# Altium project Placa E3.PrjPcb
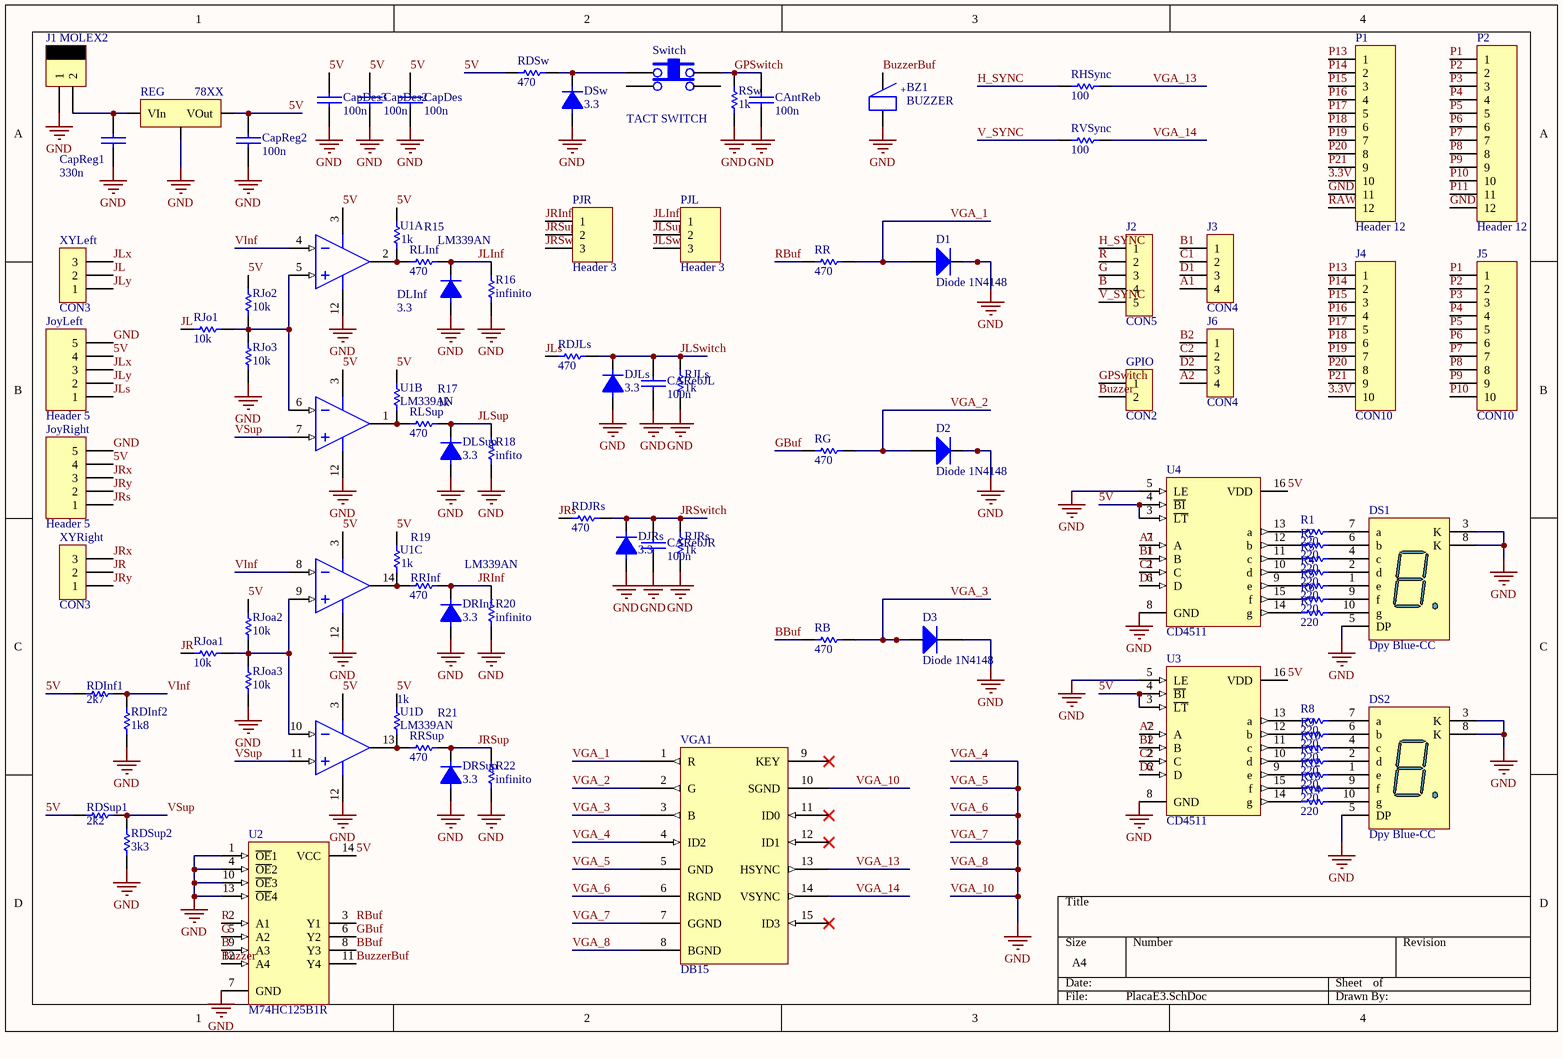
[diagram p0: PlacaE3.SchDoc]
1 sheet, 90 parts. Net scope: global (net labels, ports and power ports of the same name join across sheets).
Board file: PlacaE3.PcbDoc

## Sheet PlacaE3.SchDoc
size A4

### Parts
BZ1  BUZZER  [BUZZER 12MM]
CAntReb  100n  [CAP200]
CapDes  100n  [CAP200]
CapDes2  100n  [CAP200]
CapDes3  100n  [CAP200]
CapReg1  330n  [CAP200]
CapReg2  100n  [CAP200]
CARebJL  100n  [CAP200]
CARebJR  100n  [CAP200]
D1  Diode 1N4148  [DO-35]
D2  Diode 1N4148  [DO-35]
D3  Diode 1N4148  [DO-35]
DJLs  3.3  [DO41]
DJRs  3.3  [DO41]
DLInf  3.3  [DO41]
DLSup  3.3  [DO41]
DRInf  3.3  [DO41]
DRSup  3.3  [DO41]
DS1  Dpy Blue-CC  [H]
DS2  Dpy Blue-CC  [H]
DSw  3.3  [DO41]
GPIO  CON2  [SIP2]
J1  MOLEX2  [MOLEX2]
J2  CON5  [SIP5]
J3  CON4  [SIP4]
J4  CON10  [SIP10]
J5  CON10  [SIP10]
J6  CON4  [SIP4]
JoyLeft  Header 5  [HDR1X5]
JoyRight  Header 5  [HDR1X5]
P1  Header 12  [HDR1X12]
P2  Header 12  [HDR1X12]
PJL  Header 3  [HDR1X3]
PJR  Header 3  [HDR1X3]
R1  220  [0805]
R2  220  [0805]
R3  220  [0805]
R4  220  [0805]
R5  220  [0805]
R6  220  [0805]
R7  220  [0805]
R8  220  [0805]
R9  220  [0805]
R10  220  [0805]
R11  220  [0805]
R12  220  [0805]
R13  220  [0805]
R14  220  [0805]
R15  1k  [0805]
R16  infinito  [0805]
R17  1k  [0805]
R18  infito  [0805]
R19  1k  [0805]
R20  infinito  [0805]
R21  1k  [0805]
R22  infinito  [0805]
RB  470  [RES400]
RDInf1  2k7  [RES400]
RDInf2  1k8  [RES400]
RDJLs  470  [RES400]
RDJRs  470  [RES400]
RDSup1  2k2  [RES400]
RDSup2  3k3  [RES400]
RDSw  470  [RES400]
REG  78XX  [TO-220 V]
RG  470  [RES400]
RHSync  100  [RES400]
RJLs  1k  [RES400]
RJo1  10k  [0805]
RJo2  10k  [0805]
RJo3  10k  [0805]
RJoa1  10k  [0805]
RJoa2  10k  [0805]
RJoa3  10k  [0805]
RJRs  1k  [RES400]
RLInf  470  [RES400]
RLSup  470  [RES400]
RR  470  [RES400]
RRInf  470  [RES400]
RRSup  470  [RES400]
RSw  1k  [RES400]
RVSync  100  [RES400]
Switch  TACT SWITCH  [TACTSWITCH]
U1  LM339AN  [DIP14]  (parts A,B,C,D of 4)
U2  M74HC125B1R  [DIP14]
U3  CD4511  [DIP16]
U4  CD4511  [DIP16]
VGA1  DB15  [DB15_DSUB]
XYLeft  CON3  [SIP3]
XYRight  CON3  [SIP3]

### Nets
GND: BZ1.2 CAntReb.2 CapDes.2 CapDes2.2 CapDes3.2 CapReg1.2 CapReg2.2 CARebJL.2 CARebJR.2 D1.2(K) D2.2(K) D3.2(K) DJLs.1 DJRs.1 DLInf.1 DLSup.1 DRInf.1 DRSup.1 DS1.3(K) DS1.5(DP) DS1.8(K) DS2.3(K) DS2.5(DP) DS2.8(K) DSw.1 J1.1 JoyLeft.5 JoyRight.5 P1.11 P2.12 R16.1 R18.1 R20.1 R22.1 RDInf2.1 RDSup2.1 REG.2(GND) RJLs.1 RJo3.1 RJoa3.1 RJRs.1 RSw.1 U1.12(V-) U2.1(~{OE}1) U2.4(~{OE}2) U2.7(GND) U2.10(~{OE}3) U2.13(~{OE}4) U3.5(LE) U3.8(GND) U4.5(LE) U4.8(GND) VGA1.4(ID2) VGA1.5(GND) VGA1.6(RGND) VGA1.7(GGND) VGA1.8(BGND) VGA1.10(SGND)  [also labelled VGA_10, VGA_4, VGA_5, VGA_6, VGA_7, VGA_8]
3.3V: J4.10 P1.10
5V: CapDes.1 CapDes2.1 CapDes3.1 CapReg2.1 JoyLeft.4 JoyRight.4 R15.2 R17.2 R19.2 R21.2 RDInf1.1 RDSup1.1 RDSw.1 REG.3(VOut) RJo2.2 RJoa2.2 U1.3(V+) U2.14(VCC) U3.3(~{LT}) U3.4(~{BI}) U3.16(VDD) U4.3(~{LT}) U4.4(~{BI}) U4.16(VDD)
A1: J3.4 U4.7(A)
A2: J6.4 U3.7(A)
B: J2.4 U2.9(A3)
B1: J3.1 U4.1(B)
B2: J6.1 U3.1(B)
BBuf: RB.1 U2.8(Y3)
Buzzer: GPIO.2 U2.12(A4)
BuzzerBuf: BZ1.1 U2.11(Y4)
C1: J3.2 U4.2(C)
C2: J6.2 U3.2(C)
D1: J3.3 U4.6(D)
D2: J6.3 U3.6(D)
G: J2.3 U2.5(A2)
GBuf: RG.1 U2.6(Y2)
GPSwitch: CAntReb.1 GPIO.1 RSw.2 Switch.3
H_SYNC: J2.1 RHSync.1
JL: RJo1.1 XYLeft.2
JLInf: DLInf.2 PJL.1 R16.2 RLInf.2
JLs: JoyLeft.1 RDJLs.1
JLSup: DLSup.2 PJL.2 R18.2 RLSup.2
JLSwitch: CARebJL.1 DJLs.2 PJL.3 RDJLs.2 RJLs.2
JLx: JoyLeft.3 XYLeft.3
JLy: JoyLeft.2 XYLeft.1
JR: RJoa1.1 XYRight.2
JRInf: DRInf.2 PJR.1 R20.2 RRInf.2
JRs: JoyRight.1 RDJRs.1
JRSup: DRSup.2 PJR.2 R22.2 RRSup.2
JRSwitch: CARebJR.1 DJRs.2 PJR.3 RDJRs.2 RJRs.2
JRx: JoyRight.3 XYRight.3
JRy: JoyRight.2 XYRight.1
P1: J5.1 P2.1
P2: J5.2 P2.2
P3: J5.3 P2.3
P4: J5.4 P2.4
P5: J5.5 P2.5
P6: J5.6 P2.6
P7: J5.7 P2.7
P8: J5.8 P2.8
P9: J5.9 P2.9
P10: J5.10 P2.10
P11: P2.11
P13: J4.1 P1.1
P14: J4.2 P1.2
P15: J4.3 P1.3
P16: J4.4 P1.4
P17: J4.5 P1.5
P18: J4.6 P1.6
P19: J4.7 P1.7
P20: J4.8 P1.8
P21: J4.9 P1.9
R: J2.2 U2.2(A1)
RAW: P1.12
RBuf: RR.1 U2.3(Y1)
V_SYNC: J2.5 RVSync.1
VGA_1: D1.1(A) RR.2 VGA1.1(R)
VGA_2: D2.1(A) RG.2 VGA1.2(G)
VGA_3: D3.1(A) RB.2 VGA1.3(B)
VGA_13: RHSync.2 VGA1.13(HSYNC)
VGA_14: RVSync.2 VGA1.14(VSYNC)
VInf: RDInf1.2 RDInf2.2 U1.4(IN-) U1.8(IN-)
VSup: RDSup1.2 RDSup2.2 U1.7(IN+) U1.11(IN+)
NetCapReg1_1: CapReg1.1 J1.2 REG.1(VIn)
NetDS1_1: DS1.1(e) R5.2
NetDS1_2: DS1.2(d) R4.2
NetDS1_4: DS1.4(c) R3.2
NetDS1_6: DS1.6(b) R2.2
NetDS1_7: DS1.7(a) R1.2
NetDS1_9: DS1.9(f) R6.2
NetDS1_10: DS1.10(g) R7.2
NetDS2_1: DS2.1(e) R12.2
NetDS2_2: DS2.2(d) R11.2
NetDS2_4: DS2.4(c) R10.2
NetDS2_6: DS2.6(b) R9.2
NetDS2_7: DS2.7(a) R8.2
NetDS2_9: DS2.9(f) R13.2
NetDS2_10: DS2.10(g) R14.2
NetDSw_2: DSw.2 RDSw.2 Switch.1
NetR1_1: R1.1 U4.13(a)
NetR2_1: R2.1 U4.12(b)
NetR3_1: R3.1 U4.11(c)
NetR4_1: R4.1 U4.10(d)
NetR5_1: R5.1 U4.9(e)
NetR6_1: R6.1 U4.15(f)
NetR7_1: R7.1 U4.14(g)
NetR8_1: R8.1 U3.13(a)
NetR9_1: R9.1 U3.12(b)
NetR10_1: R10.1 U3.11(c)
NetR11_1: R11.1 U3.10(d)
NetR12_1: R12.1 U3.9(e)
NetR13_1: R13.1 U3.15(f)
NetR14_1: R14.1 U3.14(g)
NetR15_1: R15.1 RLInf.1 U1.2(OUT)
NetR17_1: R17.1 RLSup.1 U1.1(OUT)
NetR19_1: R19.1 RRInf.1 U1.14(OUT)
NetR21_1: R21.1 RRSup.1 U1.13(OUT)
NetRJo1_2: RJo1.2 RJo2.1 RJo3.2 U1.5(IN+) U1.6(IN-)
NetRJoa1_2: RJoa1.2 RJoa2.1 RJoa3.2 U1.9(IN+) U1.10(IN-)

Not connected (* = marked no-connect by the designer): Switch 2 4; VGA1 9(KEY)* 11(ID0)* 12(ID1)* 15(ID3)*

### Notes on the sheet
- (in symbol BUZZER) +

### Library data of the parts
CAntReb CapDes CapDes2 CapDes3 CapReg1 CapReg2 CARebJL CARebJR = CAP
D1-D3 = Diode 1N4148: High Conductance Fast Diode; Published: 8-Jun-2000; LatestRevisionDate: 17-Jul-2002; LatestRevisionNote: Re-released for DXP Platform.; DatasheetVersion: 1997; PackageReference: DO-35; Publisher: Altium Limited; PackageDescription: Diode, Axial; Body 3.8 x 1.9 mm (LxDia. max), Lead Dia. 0.53 mm (max); Code_JEDEC: DO-204-AH; ComponentLink1Description: Manufacturer Link; ComponentLink1URL: http://www.fairchildsemi.com/; ComponentLink2Description: Datasheet; ComponentLink2URL: http://www.fairchildsemi.com/ds/1N%2F1N4148.pdf
DJLs DJRs DLInf DLSup DRInf DRSup DSw = DIODO
DS1 DS2 = Dpy Blue-CC: 14.2 mm General Purpose Blue 7-Segment Display: CC, RH DP, Gray Surface; MinimumIntensity: 2020 ucd; Note: IF = 10 mA; Published: 8-Jun-2000; LatestRevisionDate: 17-Dec-2003; LatestRevisionNote: Schematic revised, PCB Footprint replaced.; DatasheetVersion: 24-Sep-2002; PackageVersion: 24-Sep-2002; PackageReference: H; Publisher: Altium Limited; PackageDescription: LED, 7-Segment Display, 14.2 mm, RHD; 10 Leads; Row Space 15.24 mm; Pitch 2.54 mm; Colour: Blue; ComponentLink1Description: Manufacturer Link; ComponentLink1URL: http://www.agilent.com/
JoyLeft JoyRight = Header 5: Header, 5-Pin; LatestRevisionDate: 17-Jul-2002; LatestRevisionNote: Re-released for DXP Platform.; Publisher: Altium Limited
P1 P2 = Header 12: Header, 12-Pin; LatestRevisionDate: 17-Jul-2002; LatestRevisionNote: Re-released for DXP Platform.; Publisher: Altium Limited
PJL PJR = Header 3: Header, 3-Pin; LatestRevisionDate: 17-Jul-2002; LatestRevisionNote: Re-released for DXP Platform.; Publisher: Altium Limited
R1-R22 RB RDInf1 RDInf2 RDJLs RDJRs RDSup1 RDSup2 RDSw RG RHSync RJLs RJo1-RJo3 RJoa1-RJoa3 RJRs RLInf RLSup RR RRInf RRSup RSw RVSync = RES
REG = 78XX: REGULDOR POSITIVO
U1 = LM339AN: Low-Power Quad Voltage Comparator; Published: 24-Aug-2001; LatestRevisionDate: 06-Jun-2005; LatestRevisionNote: Stylized 3D Model Added.; DatasheetVersion: Jun-1998; PackageVersion: Jan-1997; PackageReference: DIP14; Publisher: Altium Limited; PackageDescription: DIP; 14 Leads; Row Spacing 7.62 mm; Pitch 2.54 mm; ComponentLink1Description: Manufacturer Link; ComponentLink1URL: http://www.st.com/; ComponentLink2Description: Datasheet; ComponentLink2URL: http://www.st.com/stonline/products/literature/ds/2159/lm239.pdf
U2 = M74HC125B1R: Quad Bus Buffer (3-State); Published: 8-Jun-2000; LatestRevisionDate: 06-Jun-2005; LatestRevisionNote: Stylized 3D Model Added.; DatasheetVersion: Sep-1993; PackageVersion: Jan-1997; PackageReference: DIP14; Publisher: Altium Limited; PackageDescription: DIP; 14 Leads; Row Spacing 7.62 mm; Pitch 2.54 mm; ComponentLink1Description: Manufacturer Link; ComponentLink1URL: http://www.st.com/; ComponentLink2Description: Datasheet; ComponentLink2URL: http://www.st.com/stonline/products/literature/ds/1894/m74hc125.pdf
U3 U4 = CD4511: BCD to 7 SEGMENTOS
VGA1 = DB15: DB15 VGA Male Connector